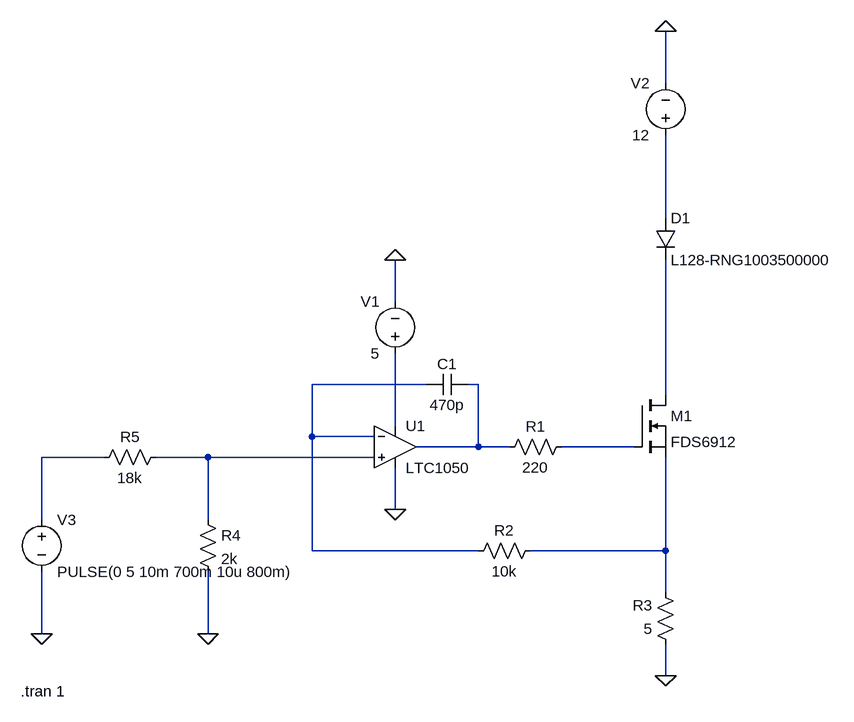
[diagram p0: schematic HR_CoverCalibrator.asc]
HR_CoverCalibrator.asc, the LTspice schematic file:
Version 4.1
SHEET 1 884 680
WIRE 608 -400 608 -480
WIRE 608 -192 608 -320
WIRE 192 -64 192 -128
WIRE 240 64 64 64
WIRE 320 64 304 64
WIRE 608 80 608 -128
WIRE 192 128 192 16
WIRE 64 144 64 64
WIRE 160 144 64 144
WIRE 320 160 320 64
WIRE 320 160 224 160
WIRE 368 160 320 160
WIRE 560 160 448 160
WIRE -256 176 -352 176
WIRE -96 176 -176 176
WIRE 160 176 -96 176
WIRE 192 256 192 192
WIRE -352 272 -352 176
WIRE -96 272 -96 176
WIRE 64 320 64 144
WIRE 320 320 64 320
WIRE 608 320 608 176
WIRE 608 320 400 320
WIRE 608 384 608 320
WIRE -352 448 -352 352
WIRE -96 448 -96 352
WIRE 608 512 608 464
FLAG 192 -128 0
FLAG 192 256 0
FLAG 608 -480 0
FLAG 608 512 0
FLAG -96 448 0
FLAG -352 448 0
SYMBOL OpAmps\\LTC1050 192 96 R0
SYMATTR InstName U1
SYMBOL voltage 192 32 R180
WINDOW 0 24 96 Left 2
WINDOW 3 24 16 Left 2
WINDOW 123 0 0 Left 0
WINDOW 39 0 0 Left 0
SYMATTR InstName V1
SYMATTR Value 5
SYMBOL cap 304 48 R90
WINDOW 0 0 32 VBottom 2
WINDOW 3 32 32 VTop 2
SYMATTR InstName C1
SYMATTR Value 470p
SYMBOL res 464 144 R90
WINDOW 0 0 56 VBottom 2
WINDOW 3 32 56 VTop 2
SYMATTR InstName R1
SYMATTR Value 220
SYMBOL nmos 560 80 R0
SYMATTR InstName M1
SYMATTR Value FDS6912
SYMBOL voltage 608 -304 R180
WINDOW 0 24 96 Left 2
WINDOW 3 24 16 Left 2
WINDOW 123 0 0 Left 0
WINDOW 39 0 0 Left 0
SYMATTR InstName V2
SYMATTR Value 12
SYMBOL res 416 304 R90
WINDOW 0 0 56 VBottom 2
WINDOW 3 32 56 VTop 2
SYMATTR InstName R2
SYMATTR Value 10k
SYMBOL res 624 480 R180
WINDOW 0 36 76 Left 2
WINDOW 3 36 40 Left 2
SYMATTR InstName R3
SYMATTR Value 5
SYMBOL voltage -352 256 R0
WINDOW 123 0 0 Left 0
WINDOW 39 0 0 Left 0
SYMATTR InstName V3
SYMATTR Value PULSE(0 5 10m 700m 10u 800m)
SYMBOL res -112 256 R0
SYMATTR InstName R4
SYMATTR Value 2k
SYMBOL res -160 160 R90
WINDOW 0 0 56 VBottom 2
WINDOW 3 32 56 VTop 2
SYMATTR InstName R5
SYMATTR Value 18k
SYMBOL diode 592 -192 R0
SYMATTR InstName D1
SYMATTR Value L128-RNG1003500000
SYMATTR Description Diode
SYMATTR Type diode
TEXT -384 536 Left 2 !.tran 1

The netlist it stands for:
* HR_CoverCalibrator.asc
X§U1 N008 N002 N005 0 N003 LTC1050  ; pins In+ In- V+ V- OUT
V1 N005 0 5
C1 N003 N002 470p
R1 N006 N003 220
M1 N004 N006 N009 N009 FDS6912
V2 N001 0 12
R2 N009 N002 10k
R3 0 N009 5
V3 N007 0 PULSE(0 5 10m 700m 10u 800m)
R4 N008 0 2k
R5 N008 N007 18k
D1 N001 N004 L128-RNG1003500000
.model D D
.lib standard.dio
.model NMOS NMOS
.model PMOS PMOS
.lib standard.mos
.tran 1
.lib LTC.lib
.backanno
.end